# Altium schematic sheet Frontend.SchDoc: Frontend - Top Level
size A4; Date: 21.09.2023; ApprovedBy: Prof. Dr. Jens Anders; Author: M.Sc. Tobias Wirth; CompanyName: IIS; DrawnBy: M.Sc. Tobias Wirth; Engineer: M.Sc. Tobias Wirth; Organization: University of Stuttgart; Address1: Pfaffenwaldring 47; Address2: 70569 Stuttgart; Revision: V1.8; SheetNumber: 1; SheetTotal: 3; Project: Austrailia - NMR System; ENG_APP_DATE: --/--/--; DSN_APP_DATE: --/--/--; CHK_APP_DATE: --/--/--; ProjectNameAlt: AUS - NRM System; Time: 15:00
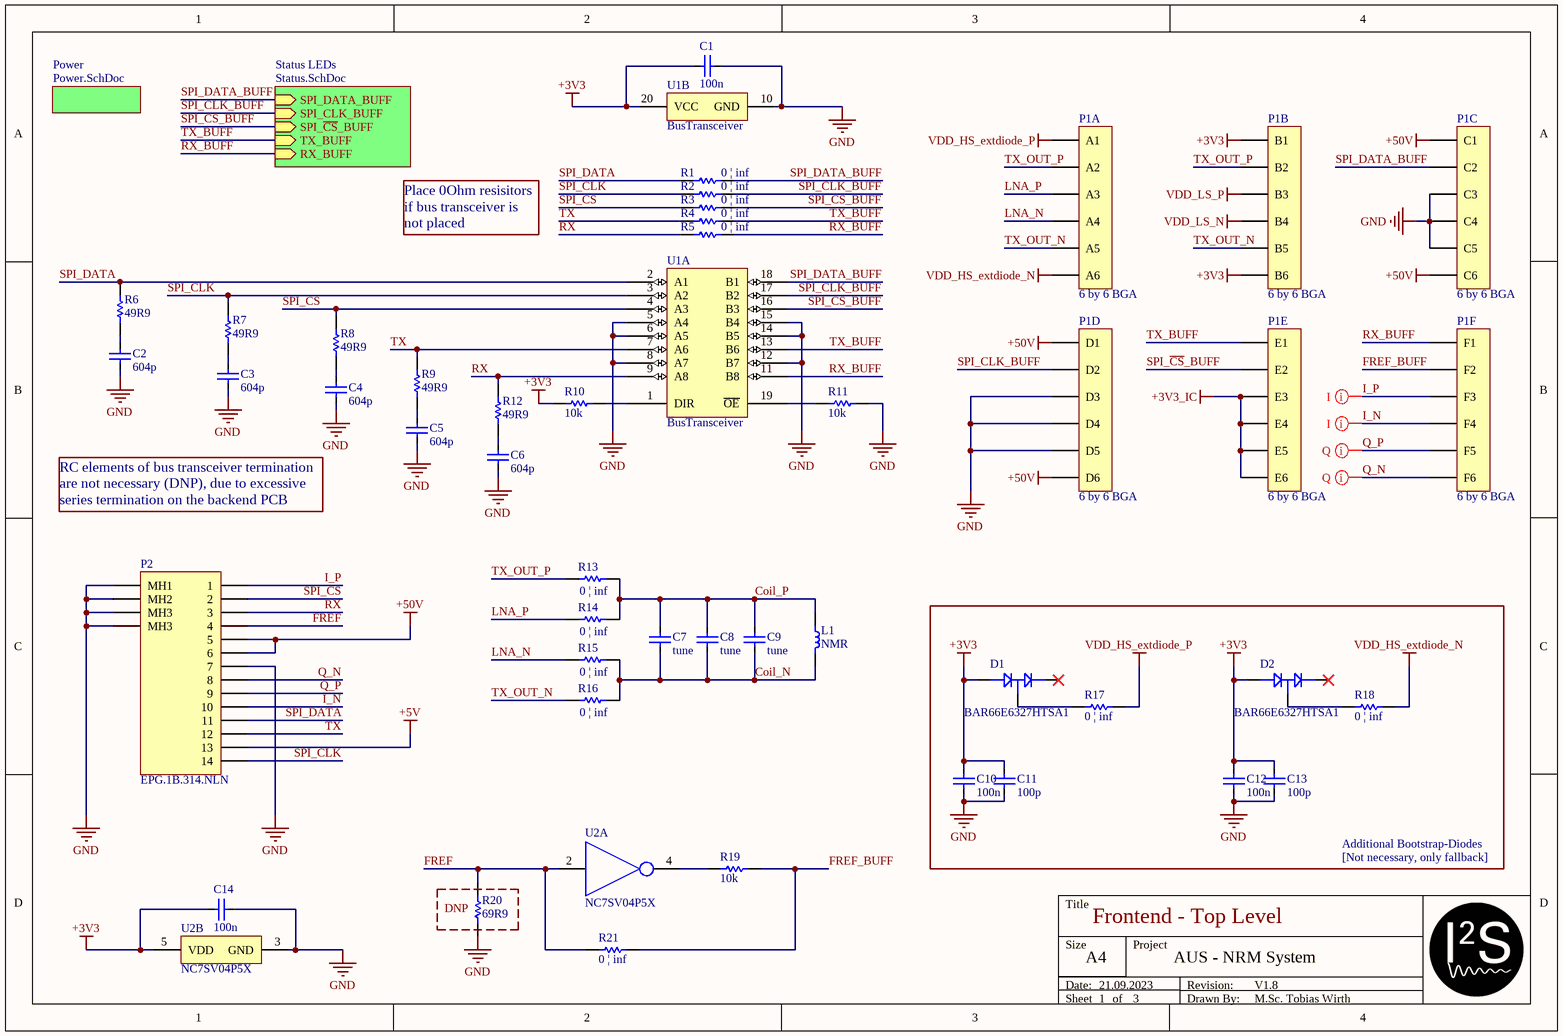
[diagram p0: Frontend.SchDoc]

## Parts
C1  100n  [CAP_0402]
C2  604p  [CAP_0402]
C3  604p  [CAP_0402]
C4  604p  [CAP_0402]
C5  604p  [CAP_0402]
C6  604p  [CAP_0402]
C7  tune  [CAP_1206]
C8  tune  [CAP_0805]
C9  tune  [CAP_0603]
C10  100n  [CAP_0402]
C11  100p  [CAP_0402]
C12  100n  [CAP_0402]
C13  100p  [CAP_0402]
C14  100n  [CAP_0402]
D1  BAR66E6327HTSA1  [SOT23]
D2  BAR66E6327HTSA1  [SOT23]
L1  NMR  [NMR-Coil-Pads]
P1  6 by 6 BGA  [BGA36C230P6X6_1500X1500X190 - Interposer]  (parts A,B,C,D,E,F of 6)
P2  EPG.1B.314.NLN  [EPG.1B.314.NLN]
R1  0 | inf  [RES_0402]
R2  0 | inf  [RES_0402]
R3  0 | inf  [RES_0402]
R4  0 | inf  [RES_0402]
R5  0 | inf  [RES_0402]
R6  49R9  [RES_0402]
R7  49R9  [RES_0402]
R8  49R9  [RES_0402]
R9  49R9  [RES_0402]
R10  10k  [RES_0402]
R11  10k  [RES_0402]
R12  49R9  [RES_0402]
R13  0 | inf  [RES_0402]
R14  0 | inf  [RES_0402]
R15  0 | inf  [RES_0402]
R16  0 | inf  [RES_0402]
R17  value 0 | inf  [RES_0402]
R18  value 0 | inf  [RES_0402]
R19  10k  [RES_0402]
R20  69R9  [RES_0603]
R21  value 0 | inf  [RES_0402]
U1  BusTransceiver  [TSSOP-20]  (parts A,B of 2)
U2  NC7SV04P5X  [SOT23-65P210X110-5N]  (parts A,B of 2)

## Blocks framed on the sheet
DNP: R20

## Sub-sheets
Power = Power.SchDoc: no entries
Status LEDs = Status.SchDoc: SPI_DATA_BUFF (in), SPI_CLK_BUFF (in), SPI_~{CS}_BUFF (in), TX_BUFF (in), RX_BUFF (in)

## Nets
+3V3: C1.1 C10.1 C11.1 C12.1 C13.1 C14.1 D1.1 D2.1 P1.B1 P1.B6 R10.1 U1.20(VCC) U2.5(VDD)
+3V3_IC: P1.E3 P1.E4 P1.E5 P1.E6
+5V: P2.13
+50V: P1.C1 P1.C6 P1.D1 P1.D6 P2.5 P2.6
GND: C1.2 C2.2 C3.2 C4.2 C5.2 C6.2 C10.2 C11.2 C12.2 C13.2 C14.2 P1.C3 P1.C4 P1.C5 P1.D3 P1.D4 P1.D5 P2.7 P2.15(MH1) P2.16(MH2) P2.17(MH3) P2.18(MH3) R11.2 R20.1 U1.5(A4) U1.6(A5) U1.8(A7) U1.10(GND) U1.12(B7) U1.14(B5) U1.15(B4) U2.3(GND)
VDD_HS_extdiode_N: P1.A6 R18.1
VDD_HS_extdiode_P: P1.A1 R17.1
VDD_LS_N: P1.B4
VDD_LS_P: P1.B3
Coil_N: C7.2 C8.2 C9.2 L1.2 R15.1 R16.1
Coil_P: C7.1 C8.1 C9.1 L1.1 R13.1 R14.1
FREF: P2.4 R20.2 R21.2 U2.2
FREF_BUFF: P1.F2 R19.2 R21.1
I_N: P1.F4 P2.10
I_P: P1.F3 P2.1
LNA_N: P1.A4 R15.2
LNA_P: P1.A3 R14.2
Q_N: P1.F6 P2.8
Q_P: P1.F5 P2.9
RX: P2.3 R5.1 R12.2 U1.9(A8)
RX_BUFF: P1.F1 R5.2 U1.11(B8) ; sheet Status LEDs/RX_BUFF
SPI_~{CS}: P2.2 R3.1 R8.2 U1.4(A3)
SPI_~{CS}_BUFF: P1.E2 R3.2 U1.16(B3) ; sheet Status LEDs/SPI_~{CS}_BUFF
SPI_CLK: P2.14 R2.1 R7.2 U1.3(A2)
SPI_CLK_BUFF: P1.D2 R2.2 U1.17(B2) ; sheet Status LEDs/SPI_CLK_BUFF
SPI_DATA: P2.11 R1.1 R6.2 U1.2(A1)
SPI_DATA_BUFF: P1.C2 R1.2 U1.18(B1) ; sheet Status LEDs/SPI_DATA_BUFF
TX: P2.12 R4.1 R9.2 U1.7(A6)
TX_BUFF: P1.E1 R4.2 U1.13(B6) ; sheet Status LEDs/TX_BUFF
TX_OUT_N: P1.A5 P1.B5 R16.2
TX_OUT_P: P1.A2 P1.B2 R13.2
NetC2_1: C2.1 R6.1
NetC3_1: C3.1 R7.1
NetC4_1: C4.1 R8.1
NetC5_1: C5.1 R9.1
NetC6_1: C6.1 R12.1
NetD1_3: D1.3 R17.2
NetD2_3: D2.3 R18.2
NetR10_2: R10.2 U1.1(DIR)
NetR11_1: R11.1 U1.19(~{OE})
NetR19_1: R19.1 U2.4

Not connected (* = marked no-connect by the designer): D1 2*; D2 2*

## Layout directives
differential pair; differential pair class IQ; net class IQ: I_N, I_P, Q_N, Q_P

## Notes on the sheet
- Place 0Ohm resisitors if bus transceiver is not placed
- RC elements of bus transceiver termination are not necessary (DNP), due to excessive series termination on the backend PCB
- Additional Bootstrap-Diodes
  [Not necessary, only fallback]
- Title
- Size
- Date:
- Sheet
- A4
- of
- Project
- Drawn By:
- Revision:

## Library data of the parts
C1-C14 = Cap: Supplier: *; Part Number: *
  C1 C10 C12 C14: Value: 100n
  C2-C6: Value: 604p
  C7-C9: Value: tune
  C11 C13: Value: 100p
D1 D2 = Diode_series: SMP1320-075LF (SC-70) / BAV99 (SOT23)
L1 = Ind: Part Number: *; Supplier: *; Value: NMR
P1 = BGA_6x6
P2 = EPG.1B.314.NLN: LEMO Connector - 14 pin EPG.1B.314.NLN Elbow receptacle for printed circuit (solder mount), Female Contact Drawing Rev. 00 Source: http://www.lemo.com/catalog/ROW/UK_English/unipole_multipole.pdf
R1-R21 = Res: Part Number: *; Supplier: *
  R1-R5 R13-R16: Value: 0 | inf
  R6-R9 R12: Value: 49R9
  R10 R11 R19: Value: 10k
  R20: Value: 69R9
U1 = 74LVC245A